# Altium schematic sheet 原理图.SchDoc
size A4
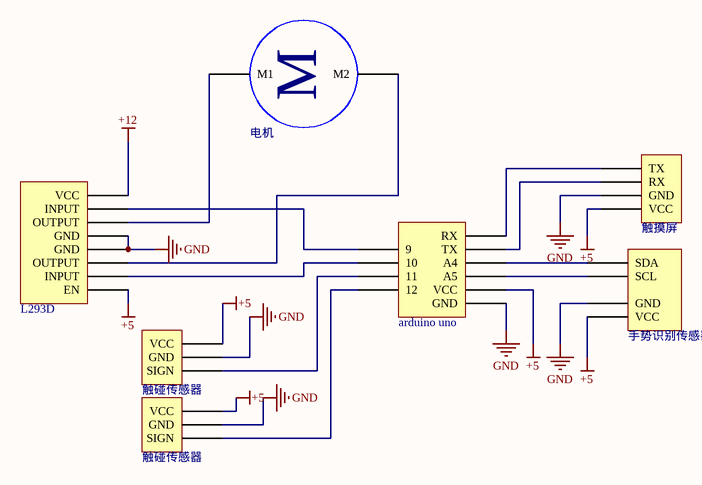
[diagram p0: 原理图.SchDoc]

## Parts
(Parts that share a designator on the sheet are numbered #1, #2 ... from top to bottom, then left to right.)
arduino_uno  arduino uno
L293D  L293D
手势识别传感器  手势识别传感器
电机  电机
触摸屏  触摸屏
触碰传感器#1  触碰传感器
触碰传感器#2  触碰传感器

## Nets
+5: arduino_uno.27(VCC) L293D.EN 手势识别传感器.VCC 触摸屏.VCC 触碰传感器#1.VCC 触碰传感器#2.VCC
+12: L293D.VCC
GND: arduino_uno.28(GND) L293D.GND 手势识别传感器.GND 触摸屏.64(GND) 触碰传感器#1.GND 触碰传感器#2.GND
Netarduino_uno_22: arduino_uno.22(9) L293D.INPUT
Netarduino_uno_23: arduino_uno.23(10) L293D.INPUT
Netarduino_uno_24: arduino_uno.24(11) 触碰传感器#1.SIGN
Netarduino_uno_25: arduino_uno.25(12) 触碰传感器#2.SIGN
Netarduino_uno_26: arduino_uno.26(A5) 手势识别传感器.SCL
Netarduino_uno_29: arduino_uno.29(TX) 触摸屏.65(RX)
Netarduino_uno_30: arduino_uno.30(RX) 触摸屏.RX(TX)
Netarduino_uno_31: arduino_uno.31(A4) 手势识别传感器.SDA
NetL293D_OUTPUT: L293D.OUTPUT 电机.39(M1)
NetL293D_OUTPUT: L293D.OUTPUT 电机.41(M2)  [a separate net that carries the same name]

## Notes on the sheet
- (in symbol 电机) M